# Altium project OBDH_Ed01r1.PrjPcb
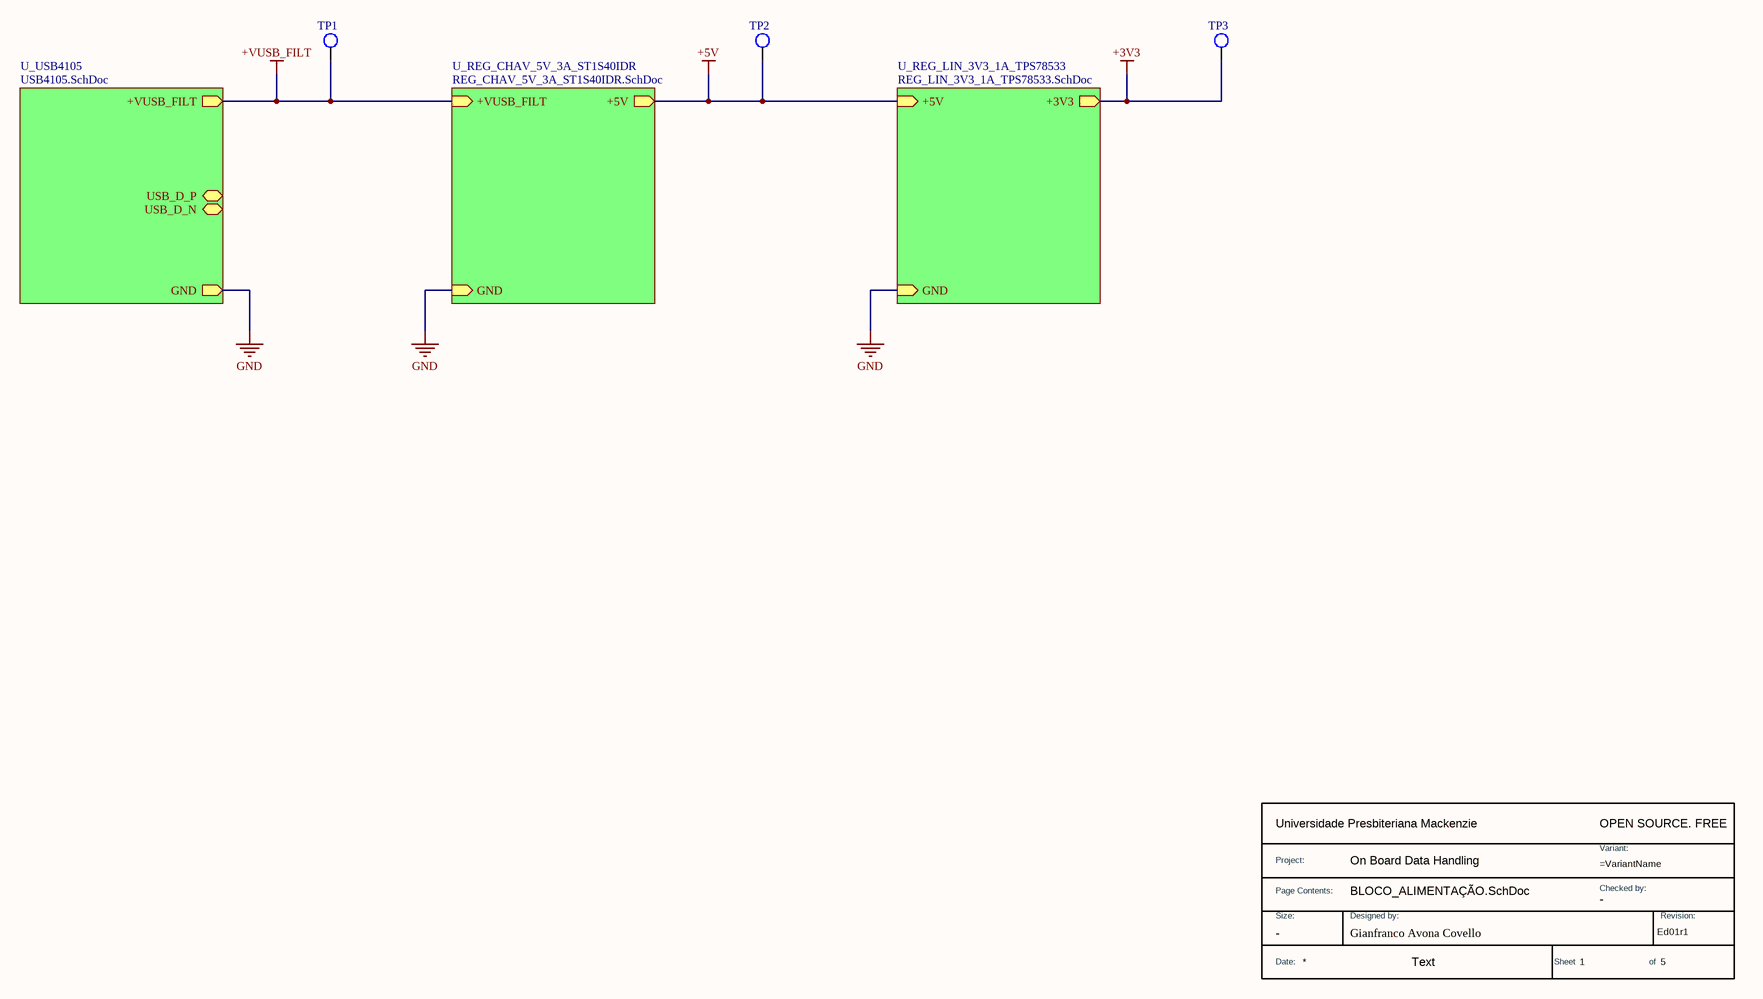
[diagram p0: BLOCO_ALIMENTAÇÃO.SchDoc]
Company: Universidade Presbiteriana Mackenzie; Project: On Board Data Handling; ProjectEngineer: Gianfranco Avona Covello; VersionRevision: Ed01r1
9 sheets, 96 parts. Net scope: hierarchical (ports join the sheet entries above them; power ports are global).
Sheets:
  BLOCO_ALIMENTAÇÃO.SchDoc
    U_USB4105 = USB4105.SchDoc
    U_REG_CHAV_5V_3A_ST1S40IDR = REG_CHAV_5V_3A_ST1S40IDR.SchDoc
    U_REG_LIN_3V3_1A_TPS78533 = REG_LIN_3V3_1A_TPS78533.SchDoc
  BLOCO_PROCESSAMENTO.SchDoc
    U_STM32L412CBT6 = STM32L412CBT6.SchDoc
    U_MLX90393SLQ = MLX90393SLQ.SchDoc
    U_LSM6DSOTR = LSM6DSOTR.SchDoc
  ADF7020BCPZ-RL.SchDoc

## Sheet BLOCO_ALIMENTAÇÃO.SchDoc
size A3; Engineer: Gianfranco Avona Covello; SheetNumber: 1; SheetTotal: 5

### Parts
(Parts that share a designator on the sheet are numbered #1, #2 ... from top to bottom, then left to right.)
*#1  DWG NO: Gianfranco Avona Covello  (hidden comment: TitleBlock)  (graphical)
TP1  TEST_POINT_1.5MM  [TESTPOINT_1.5MM]  (value not drawn)  (no BOM)
TP2  TEST_POINT_1.5MM  [TESTPOINT_1.5MM]  (value not drawn)  (no BOM)
TP3  TEST_POINT_1.5MM  [TESTPOINT_1.5MM]  (value not drawn)  (no BOM)

### Sub-sheets
U_REG_CHAV_5V_3A_ST1S40IDR = REG_CHAV_5V_3A_ST1S40IDR.SchDoc: +VUSB_FILT (in), +5V (out), GND (in)
U_REG_LIN_3V3_1A_TPS78533 = REG_LIN_3V3_1A_TPS78533.SchDoc: +5V (in), GND (in), +3V3 (out)
U_USB4105 = USB4105.SchDoc: USB_D_P (bidir), USB_D_N (bidir), +VUSB_FILT (out), GND (out)

### Nets
+3V3: TP3.1 ; sheet U_REG_LIN_3V3_1A_TPS78533/+3V3
+5V: TP2.1 ; sheet U_REG_CHAV_5V_3A_ST1S40IDR/+5V, sheet U_REG_LIN_3V3_1A_TPS78533/+5V
+VUSB_FILT: TP1.1 ; sheet U_USB4105/+VUSB_FILT, sheet U_REG_CHAV_5V_3A_ST1S40IDR/+VUSB_FILT
GND: sheet U_USB4105/GND, sheet U_REG_CHAV_5V_3A_ST1S40IDR/GND, sheet U_REG_LIN_3V3_1A_TPS78533/GND

### Notes on the sheet
- Todas as informações e detalhes técnicos deste documento são de inteira propriedade da empresa V2COM,
- não poderão ser copiados, reduzidos ou cedidos a terceiros sem prévia autorização por escrito da mesma.
- Salvo em (D/M/A):
- Página:
- de
- Nome do Projeto:
- https://v2com.com/
- Ed.:
- Responsável:
- Nome da página:
- Rev.:
- Projetista:
- Obs.:
- Revisor:
- Arquivo:
- -
- (in symbol TitleBlock) OPEN SOURCE. FREE; Project:; Variant:; Page Contents:; Checked by:; Size:; Designed by:; Revision:; Date:; Text; Sheet; of

### Library data of the parts
*#1 = TitleBlock: Standard Title Block; Size: -; Checked by: -
TP1-TP3 = TEST_POINT_1.5MM: TEST_POINT; Manufacturer: V2COM; Origem: GT1021_ED02r2; Case/Package: SMD; Manufacturer Part Number: TEST_POINT; Observação: *; Valor: *

## Sheet USB4105.SchDoc
size A4; Engineer: Gianfranco Avona Covello; SheetNumber: 2; SheetTotal: 8
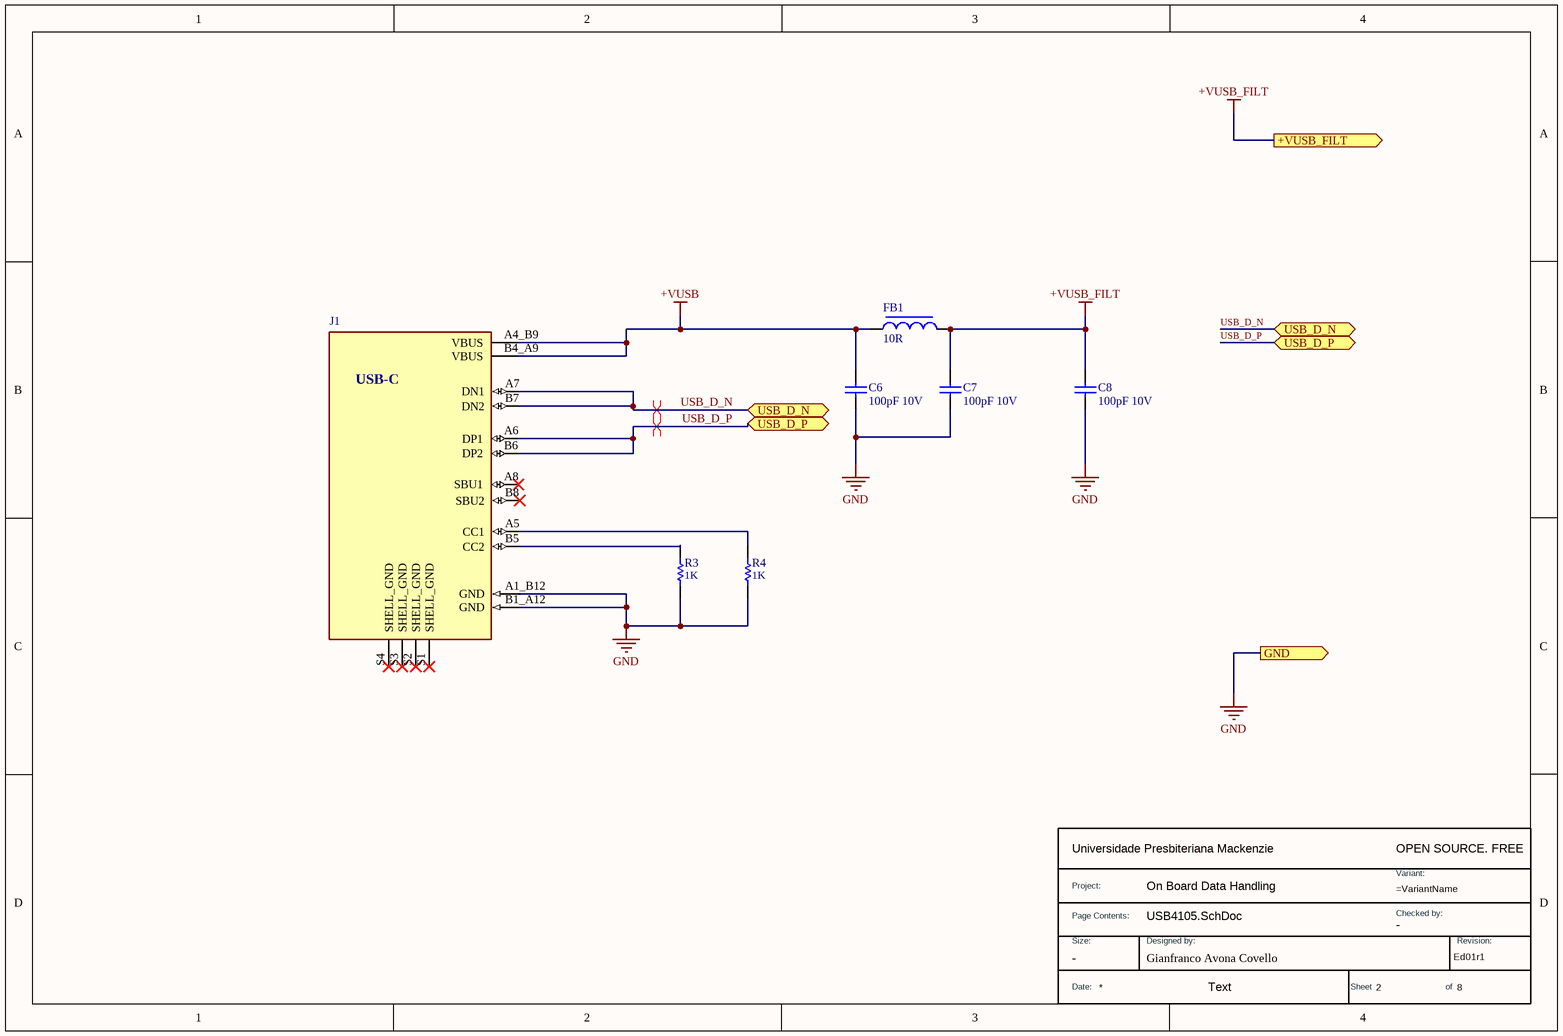
[diagram p1: USB4105.SchDoc]

### Parts
(Parts that share a designator on the sheet are numbered #1, #2 ... from top to bottom, then left to right.)
*#2  DWG NO: Gianfranco Avona Covello  (hidden comment: TitleBlock)  (graphical)
C6  value 100pF 10V  (hidden comment: _Capacitor)
C7  value 100pF 10V  (hidden comment: _Capacitor)
C8  value 100pF 10V  (hidden comment: _Capacitor)
FB1  value 10R  (hidden comment: _FERRITE)
J1  USB4105-GF-A  [GCT_USB4105-GF-A]  (value not drawn)
R3  value 1K  (hidden comment: _Resistor)
R4  value 1K  (hidden comment: _Resistor)

### Ports
+VUSB_FILT (out, see 1[3B], 3[1A]), GND (out, see 1[3C], 3[1A], 4[1A]), USB_D_N (bidir, see 1[3B]), USB_D_P (bidir, see 1[3B])

### Nets
+VUSB: C6.2 FB1.1 J1.A4_B9(VBUS) J1.B4_A9(VBUS)
+VUSB_FILT: C7.2 C8.2 FB1.2 ; port +VUSB_FILT
GND: C6.1 C7.1 C8.1 J1.A1_B12(GND) J1.B1_A12(GND) R3.1 R4.1 ; port GND
USB_D_N: J1.A7(DN1) J1.B7(DN2) ; port USB_D_N
USB_D_P: J1.A6(DP1) J1.B6(DP2) ; port USB_D_P
NetJ1_A5: J1.A5(CC1) R4.2
NetJ1_B5: J1.B5(CC2) R3.2

Not connected (* = marked no-connect by the designer): J1 A8(SBU1)* B8(SBU2)* S1(SHELL_GND)* S2(SHELL_GND)* S3(SHELL_GND)* S4(SHELL_GND)*

### Layout directives
differential pair; differential pair class USB: USB_D_N, USB_D_P

### Notes on the sheet
- Todas as informações e detalhes técnicos deste documento são de inteira propriedade da empresa V2COM,
- não poderão ser copiados, reduzidos ou cedidos a terceiros sem prévia autorização por escrito da mesma.
- Salvo em (D/M/A):
- Página:
- de
- Nome do Projeto:
- https://v2com.com/
- Ed.:
- Responsável:
- Nome da página:
- Rev.:
- Projetista:
- Obs.:
- Revisor:
- Arquivo:
- -
- (in symbol TitleBlock) OPEN SOURCE. FREE; Project:; Variant:; Page Contents:; Checked by:; Size:; Designed by:; Revision:; Date:; Text; Sheet; of
- (in symbol USB4105-GF-A) USB-C

### Library data of the parts
*#2 = TitleBlock: Standard Title Block; Size: -; Checked by: -
C6-C8 = _Capacitor: Capacitor; Published: 8-Jun-2000; LatestRevisionDate: 17-Jul-2002; LatestRevisionNote: Re-released for DXP Platform.; PackageReference: RAD-0.3; Publisher: Altium Limited; PackageDescription: Radial Cap, Thru-Hole; 2 Leads; 0.3 in Pin Spacing
FB1 = _FERRITE: Ferrite Bead; Code_IEC: 1005; Published: 8-Jun-2000; LatestRevisionDate: 29-May-2009; LatestRevisionNote: IPC-7351 Footprint Added.; PackageReference: 0402-A; Publisher: Altium Limited; PackageDescription: Chip Inductor; Code_JEITA: 0402
J1 = USB4105-GF-A: USB-C (USB TYPE-C) USB 2.0 Receptacle Connector 24 (16+8 Dummy) Position Surface Mount, Right Angle; Through Hole; MF: GCT; Price: None; Availability: In Stock; MP: USB4105-GF-A; Package: None; SnapEDA_Link: https://www.snapeda.com/parts/USB4105-GF-A/Global+Connector+Technology/view-part/?ref=snap; Check_prices: https://www.snapeda.com/parts/USB4105-GF-A/Global+Connector+Technology/view-part/?ref=eda; Value: *; Purchase-URL: https://pricing.snapeda.com/search/part/USB4105-GF-A/?ref=eda
R3 R4 = _Resistor: Resistor; Published: 8-Jun-2000; LatestRevisionDate: 17-Jul-2002; LatestRevisionNote: Re-released for DXP Platform.; PackageReference: AXIAL-0.3; Publisher: Altium Limited; PackageDescription: Axial Device, Thru-Hole; 2 Leads; 0.3 in Pin Spacing

## Sheet REG_CHAV_5V_3A_ST1S40IDR.SchDoc
size A4; Engineer: Gianfranco Avona Covello; SheetNumber: 3; SheetTotal: 8
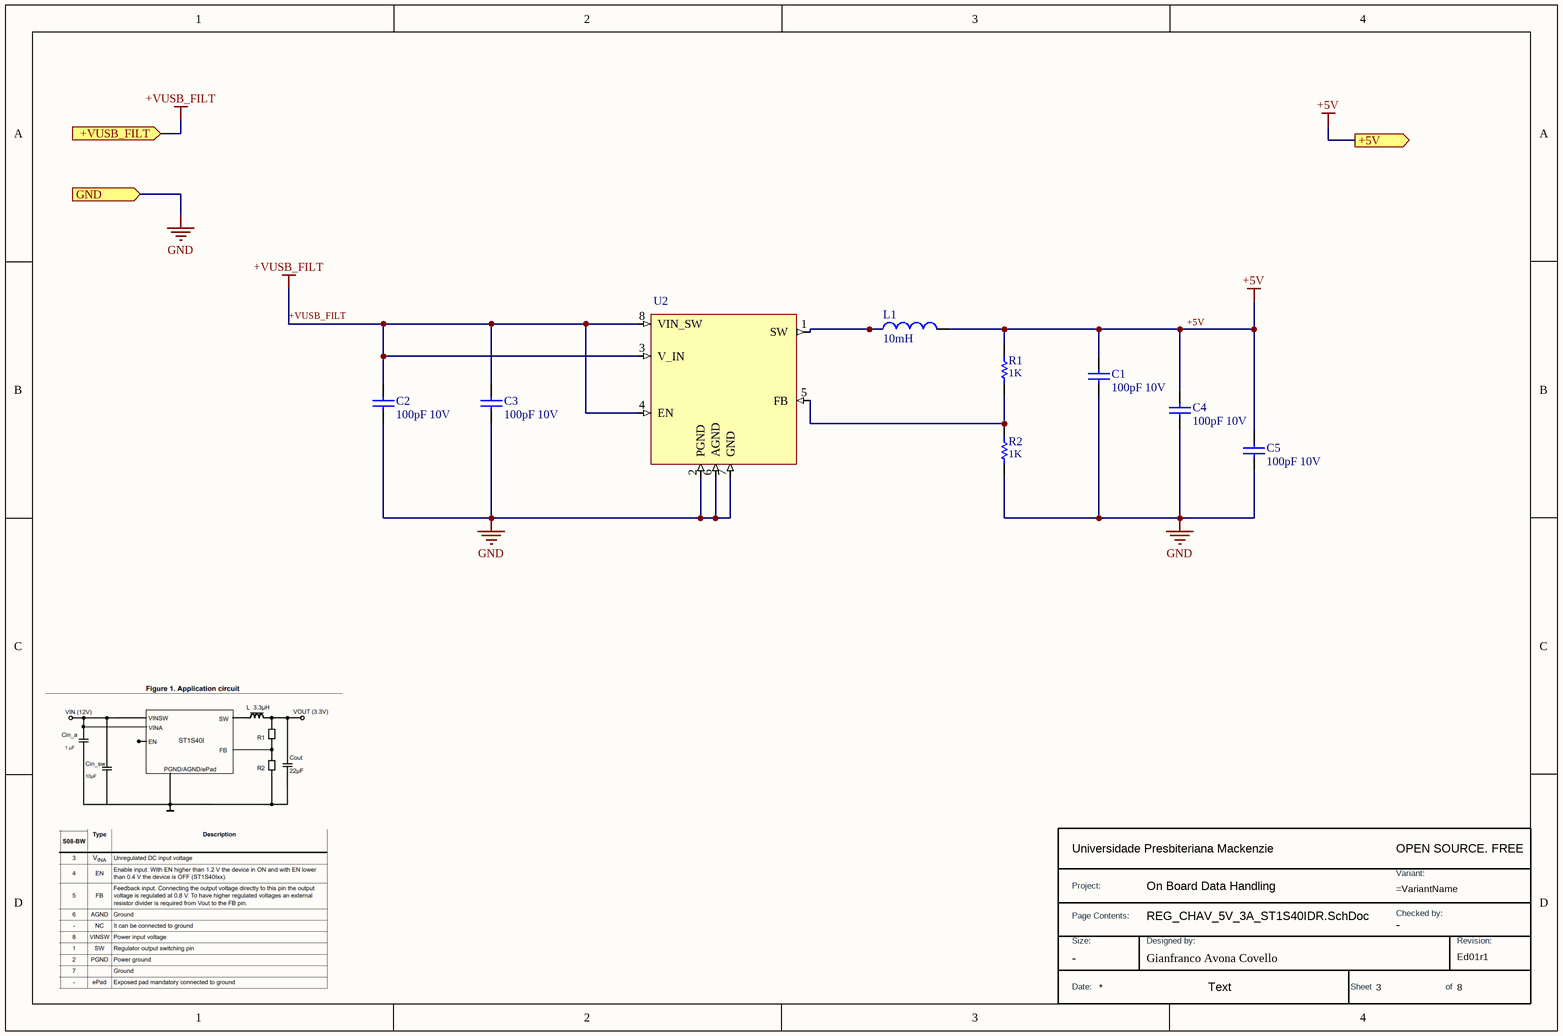
[diagram p2: REG_CHAV_5V_3A_ST1S40IDR.SchDoc]

### Parts
(Parts that share a designator on the sheet are numbered #1, #2 ... from top to bottom, then left to right.)
*#3  DWG NO: Gianfranco Avona Covello  (hidden comment: TitleBlock)  (graphical)
C1  value 100pF 10V  (hidden comment: _Capacitor)
C2  value 100pF 10V  (hidden comment: _Capacitor)
C3  value 100pF 10V  (hidden comment: _Capacitor)
C4  value 100pF 10V  (hidden comment: _Capacitor)
C5  value 100pF 10V  (hidden comment: _Capacitor)
L1  value 10mH  (hidden comment: _Inductor)
R1  value 1K  (hidden comment: _Resistor)
R2  value 1K  (hidden comment: _Resistor)
U2  ST1S40IDR  (value not drawn)

### Ports
+5V (out, see 1[4B], 4[1A]), +VUSB_FILT (in, see 1[3B], 2[4A]), GND (in, see 1[3C], 2[4A], 4[1A])

### Nets
+5V: C1.2 C4.2 C5.2 L1.2 R1.2 ; port +5V
+VUSB_FILT: C2.2 C3.2 U2.3(V_IN) U2.4(EN) U2.8(VIN_SW) ; port +VUSB_FILT
GND: C1.1 C2.1 C3.1 C4.1 C5.1 R2.1 U2.2(PGND) U2.6(AGND) U2.7(GND) ; port GND
NetL1_1: L1.1 U2.1(SW)
NetR1_1: R1.1 R2.2 U2.5(FB)

### Notes on the sheet
- Todas as informações e detalhes técnicos deste documento são de inteira propriedade da empresa V2COM,
- não poderão ser copiados, reduzidos ou cedidos a terceiros sem prévia autorização por escrito da mesma.
- Salvo em (D/M/A):
- Página:
- de
- Nome do Projeto:
- https://v2com.com/
- Ed.:
- Responsável:
- Nome da página:
- Rev.:
- Projetista:
- Obs.:
- Revisor:
- Arquivo:
- -
- (in symbol TitleBlock) OPEN SOURCE. FREE; Project:; Variant:; Page Contents:; Checked by:; Size:; Designed by:; Revision:; Date:; Text; Sheet; of

### Library data of the parts
*#3 = TitleBlock: Standard Title Block; Size: -; Checked by: -
C1-C5 = _Capacitor: Capacitor; Published: 8-Jun-2000; LatestRevisionDate: 17-Jul-2002; LatestRevisionNote: Re-released for DXP Platform.; PackageReference: RAD-0.3; Publisher: Altium Limited; PackageDescription: Radial Cap, Thru-Hole; 2 Leads; 0.3 in Pin Spacing
L1 = _Inductor: Inductor; Code_IEC: 1005; Published: 8-Jun-2000; LatestRevisionDate: 29-May-2009; LatestRevisionNote: IPC-7351 Footprint Added.; PackageReference: 0402-A; Publisher: Altium Limited; PackageDescription: Chip Inductor; Code_JEITA: 0402
R1 R2 = _Resistor: Resistor; Published: 8-Jun-2000; LatestRevisionDate: 17-Jul-2002; LatestRevisionNote: Re-released for DXP Platform.; PackageReference: AXIAL-0.3; Publisher: Altium Limited; PackageDescription: Axial Device, Thru-Hole; 2 Leads; 0.3 in Pin Spacing
U2 = ST1S40IDR: IC REG BUCK ADJUSTABLE 3A 8SO

## Sheet REG_LIN_3V3_1A_TPS78533.SchDoc
size A4; Engineer: Gianfranco Avona Covello; SheetNumber: 4; SheetTotal: 4
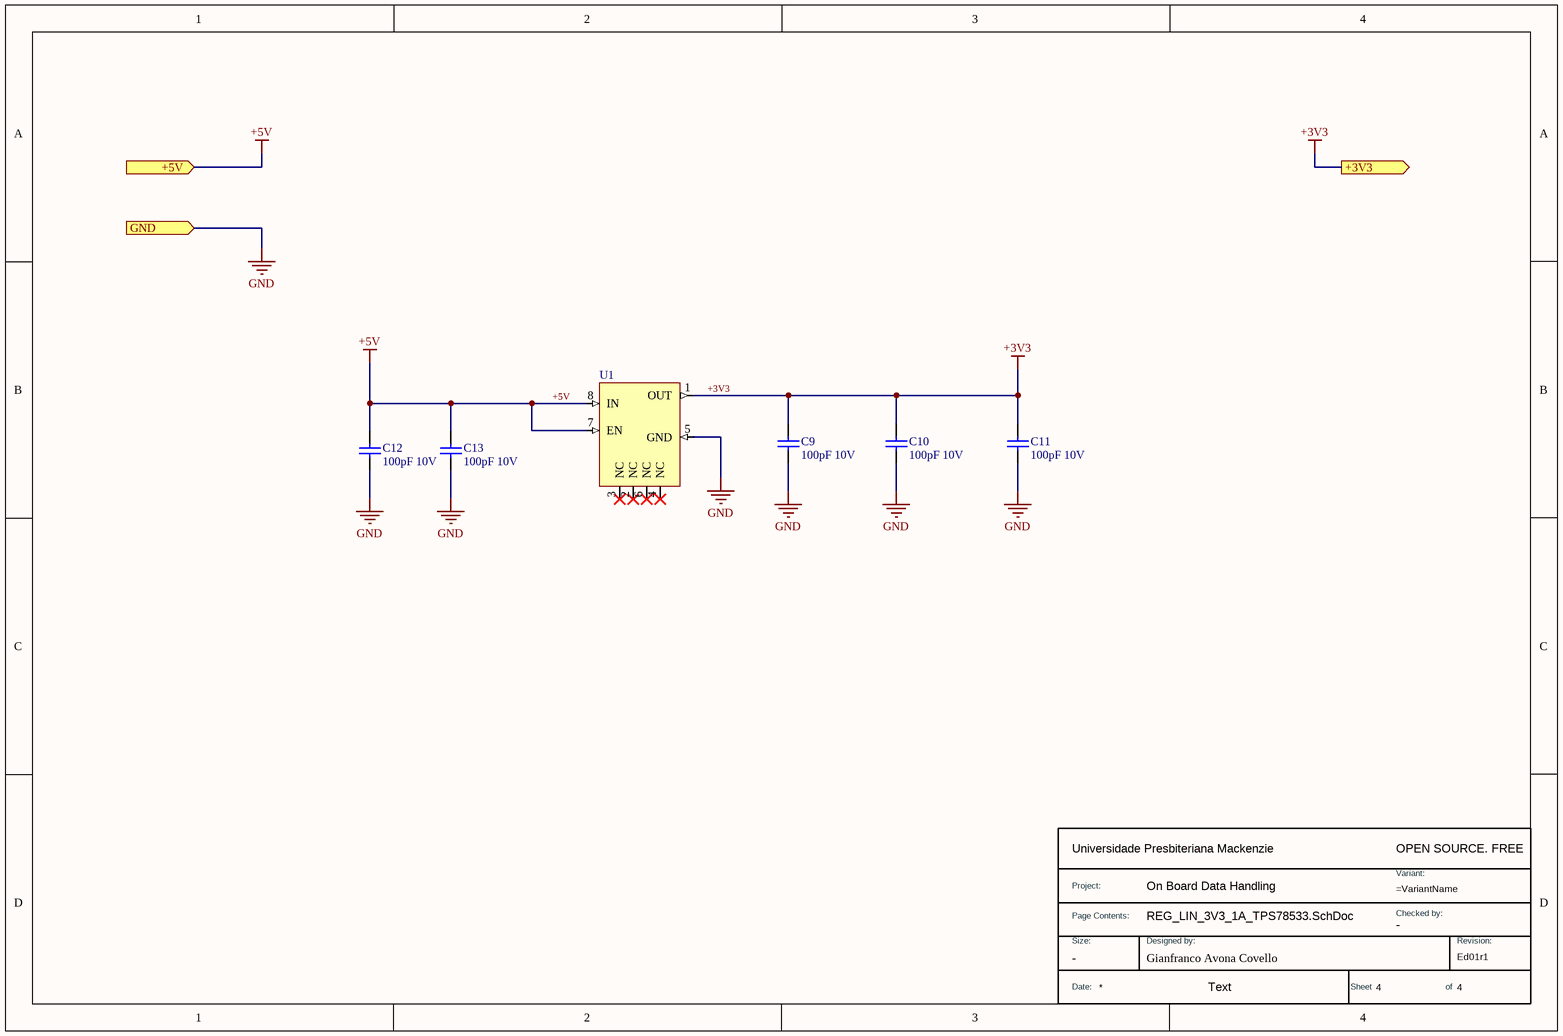
[diagram p3: REG_LIN_3V3_1A_TPS78533.SchDoc]

### Parts
(Parts that share a designator on the sheet are numbered #1, #2 ... from top to bottom, then left to right.)
*#4  DWG NO: Gianfranco Avona Covello  (hidden comment: TitleBlock)  (graphical)
C9  value 100pF 10V  (hidden comment: _Capacitor)
C10  value 100pF 10V  (hidden comment: _Capacitor)
C11  value 100pF 10V  (hidden comment: _Capacitor)
C12  value 100pF 10V  (hidden comment: _Capacitor)
C13  value 100pF 10V  (hidden comment: _Capacitor)
U1  TPS78533QWDRBRQ1  (value not drawn)

### Ports
+3V3 (out, see 1[7B]), +5V (in, see 1[6B], 3[4A]), GND (in, see 1[6C], 2[4A], 3[1A])

### Nets
+3V3: C9.1 C10.1 C11.1 U1.1(OUT) ; port +3V3
+5V: C12.1 C13.1 U1.7(EN) U1.8(IN) ; port +5V
GND: C9.2 C10.2 C11.2 C12.2 C13.2 U1.5(GND) ; port GND

Not connected (* = marked no-connect by the designer): U1 2(NC)* 3(NC)* 4(NC)* 6(NC)*

### Notes on the sheet
- Todas as informações e detalhes técnicos deste documento são de inteira propriedade da empresa V2COM,
- não poderão ser copiados, reduzidos ou cedidos a terceiros sem prévia autorização por escrito da mesma.
- Salvo em (D/M/A):
- Página:
- de
- Nome do Projeto:
- https://v2com.com/
- Ed.:
- Responsável:
- Nome da página:
- Rev.:
- Projetista:
- Obs.:
- Revisor:
- Arquivo:
- -
- (in symbol TitleBlock) OPEN SOURCE. FREE; Project:; Variant:; Page Contents:; Checked by:; Size:; Designed by:; Revision:; Date:; Text; Sheet; of

### Library data of the parts
*#4 = TitleBlock: Standard Title Block; Size: -; Checked by: -
C9-C13 = _Capacitor: Capacitor; Published: 8-Jun-2000; LatestRevisionDate: 17-Jul-2002; LatestRevisionNote: Re-released for DXP Platform.; PackageReference: RAD-0.3; Publisher: Altium Limited; PackageDescription: Radial Cap, Thru-Hole; 2 Leads; 0.3 in Pin Spacing
U1 = TPS78533QWDRBRQ1: Linear Voltage Regulator IC Positive Fixed 1 Output 1A 8-SON (3x3)

## Sheet BLOCO_PROCESSAMENTO.SchDoc
size A3; Engineer: Gianfranco Avona Covello; SheetNumber: 5; SheetTotal: 8
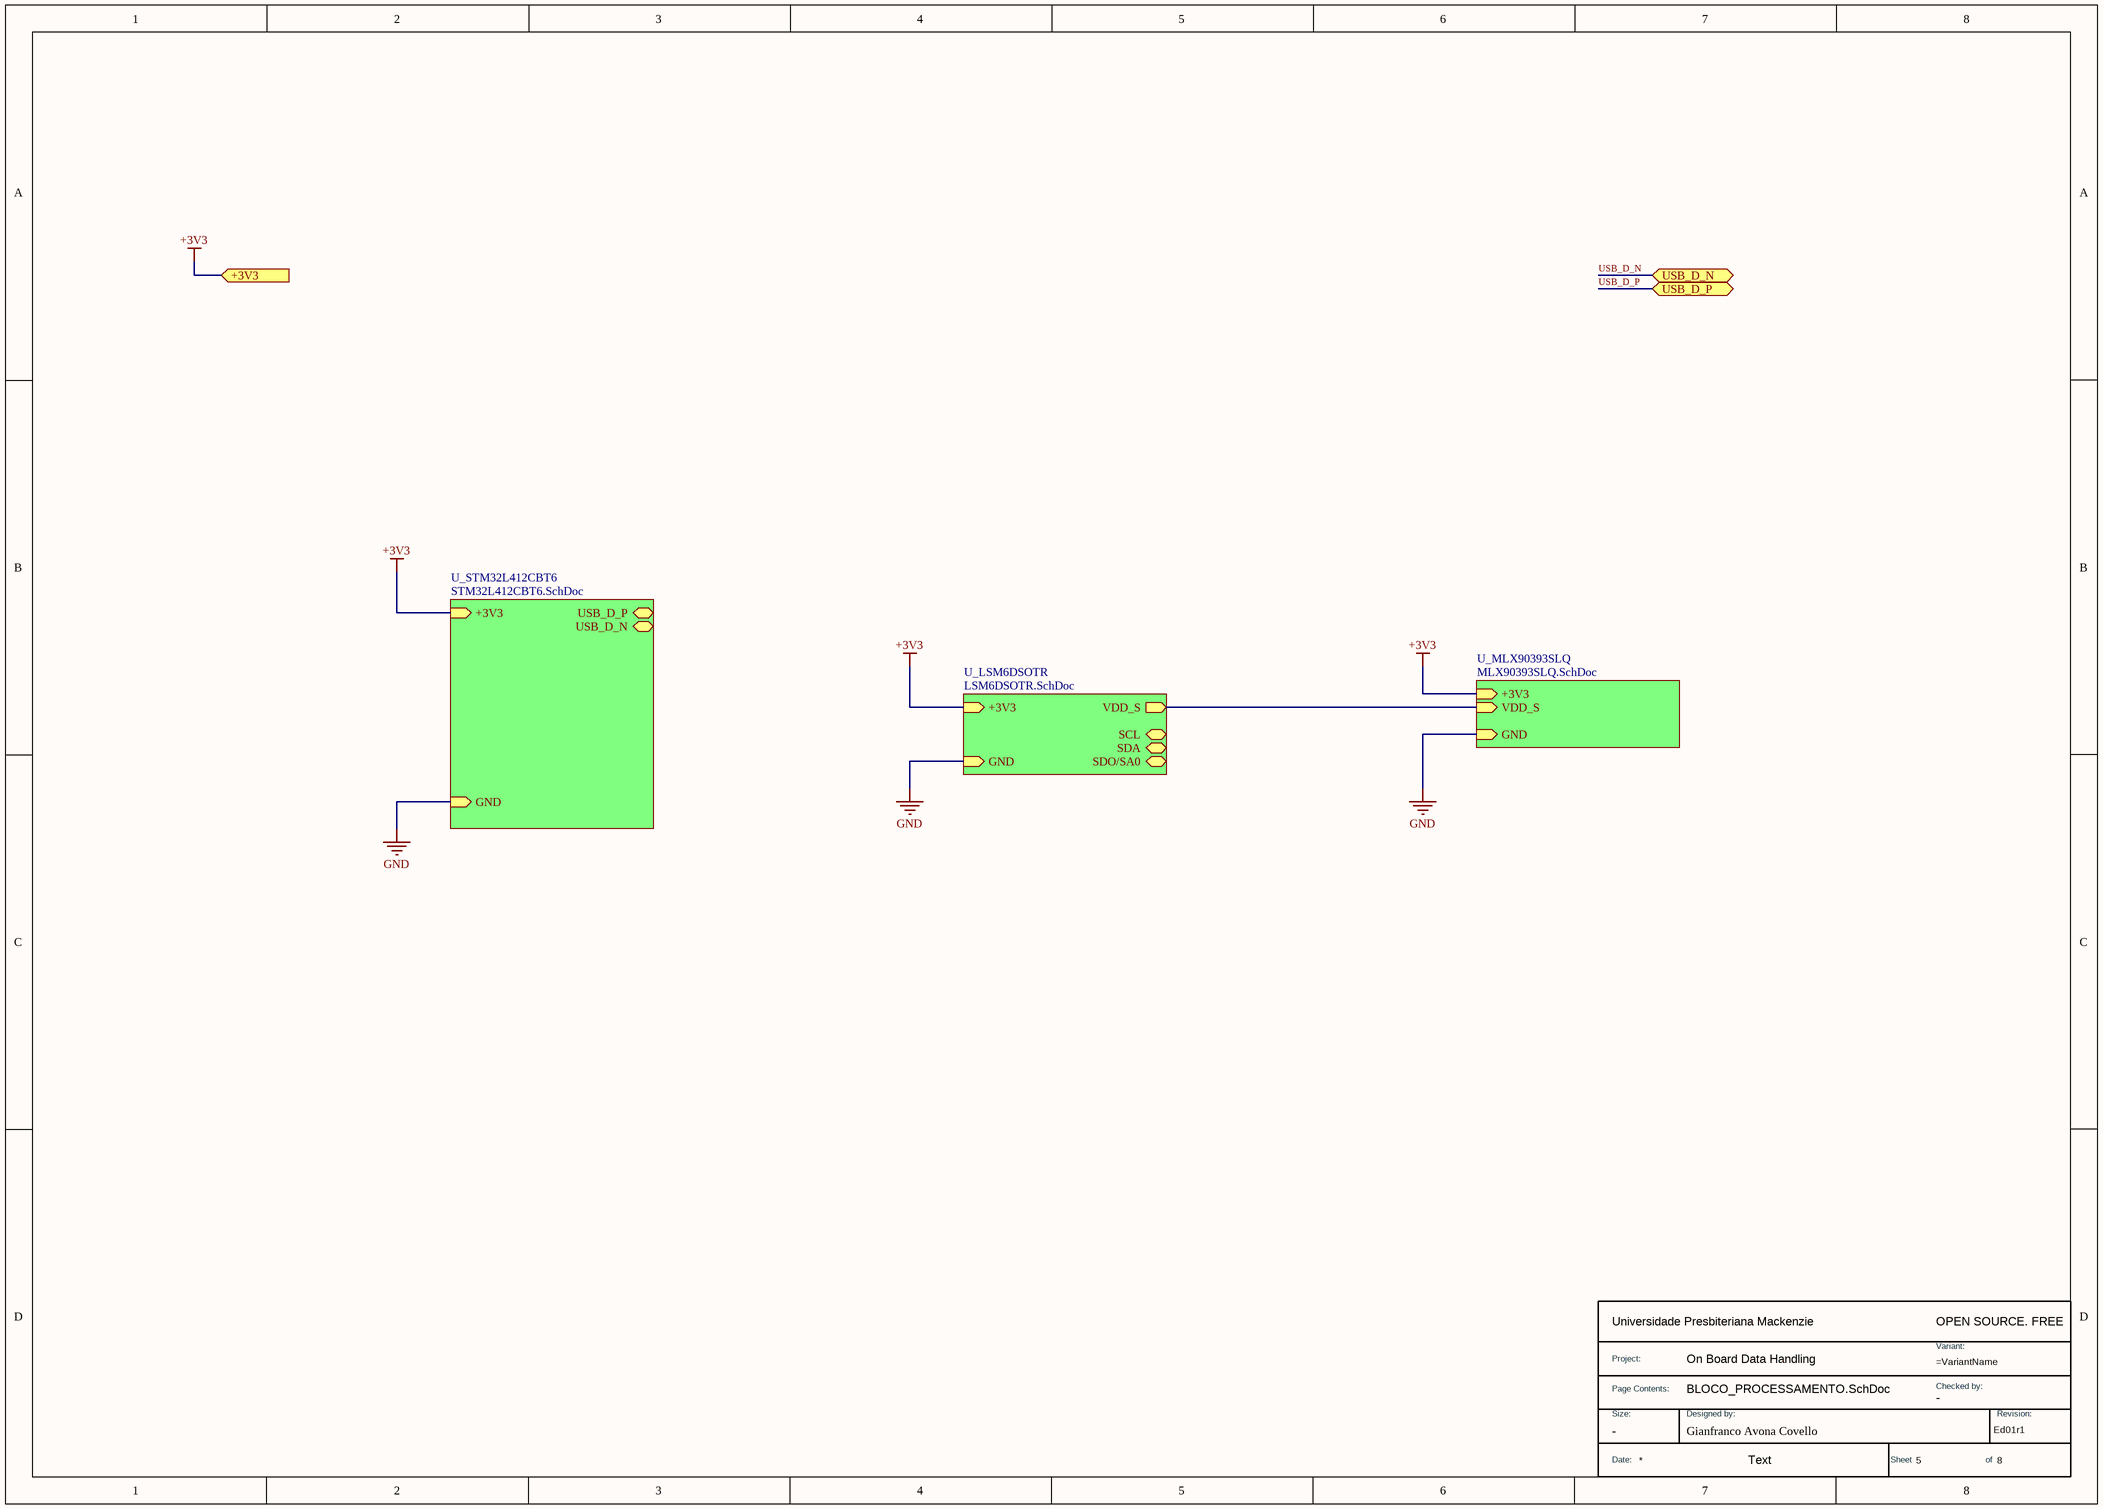
[diagram p4: BLOCO_PROCESSAMENTO.SchDoc]

### Parts
(Parts that share a designator on the sheet are numbered #1, #2 ... from top to bottom, then left to right.)
*#5  DWG NO: Gianfranco Avona Covello  (hidden comment: TitleBlock)  (graphical)

### Sub-sheets
U_LSM6DSOTR = LSM6DSOTR.SchDoc: GND (in), +3V3 (in), SCL (bidir), SDA (bidir), SDO/SA0 (bidir), VDD_S (out)
U_MLX90393SLQ = MLX90393SLQ.SchDoc: VDD_S (in), GND (in), +3V3 (in)
U_STM32L412CBT6 = STM32L412CBT6.SchDoc: +3V3 (in), USB_D_P (bidir), USB_D_N (bidir), GND (in)

### Ports
+3V3 (in, see 1[6B]), USB_D_N (bidir, see 1[3B]), USB_D_P (bidir, see 1[3B])

### Nets
+3V3: port +3V3, sheet U_STM32L412CBT6/+3V3, sheet U_MLX90393SLQ/+3V3, sheet U_LSM6DSOTR/+3V3
GND: sheet U_STM32L412CBT6/GND, sheet U_MLX90393SLQ/GND, sheet U_LSM6DSOTR/GND
USB_D_N: port USB_D_N
USB_D_P: port USB_D_P
(unnamed): sheet U_MLX90393SLQ/VDD_S, sheet U_LSM6DSOTR/VDD_S

### Notes on the sheet
- Todas as informações e detalhes técnicos deste documento são de inteira propriedade da empresa V2COM,
- não poderão ser copiados, reduzidos ou cedidos a terceiros sem prévia autorização por escrito da mesma.
- Salvo em (D/M/A):
- Página:
- de
- Nome do Projeto:
- https://v2com.com/
- Ed.:
- Responsável:
- Nome da página:
- Rev.:
- Projetista:
- Obs.:
- Revisor:
- Arquivo:
- -
- (in symbol TitleBlock) OPEN SOURCE. FREE; Project:; Variant:; Page Contents:; Checked by:; Size:; Designed by:; Revision:; Date:; Text; Sheet; of

### Library data of the parts
*#5 = TitleBlock: Standard Title Block; Size: -; Checked by: -

## Sheet STM32L412CBT6.SchDoc
size A3; Engineer: Gianfranco Avona Covello; SheetNumber: 6; SheetTotal: 9
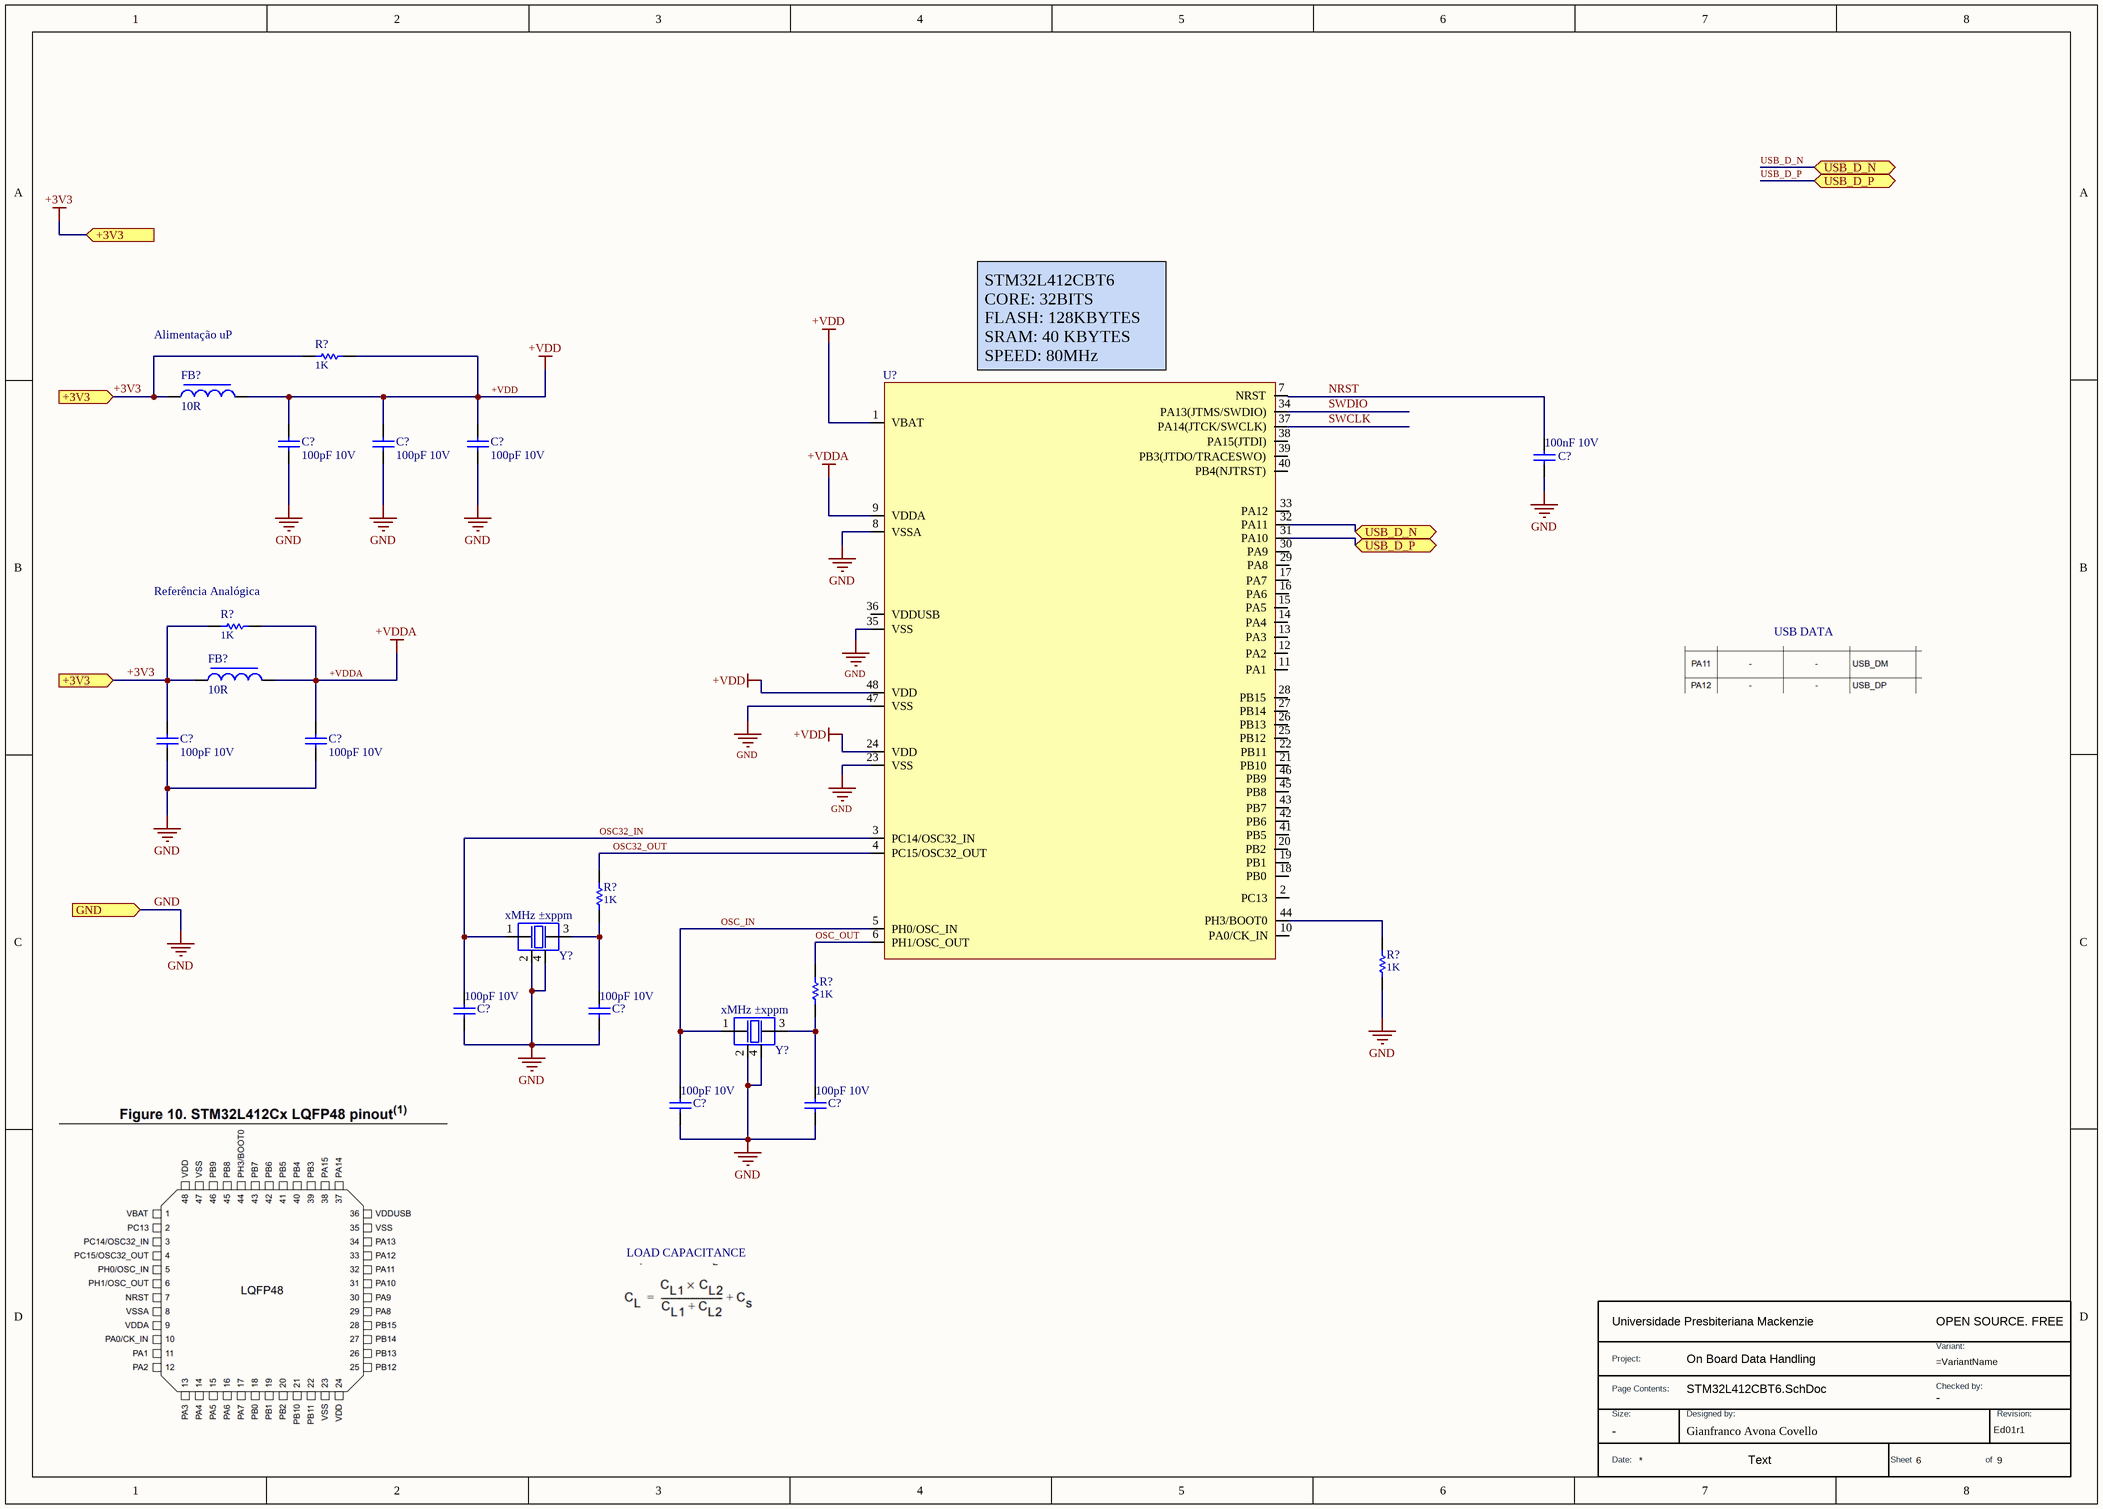
[diagram p5: STM32L412CBT6.SchDoc]

### Parts
(Parts that share a designator on the sheet are numbered #1, #2 ... from top to bottom, then left to right.)
*#6  DWG NO: Gianfranco Avona Covello  (hidden comment: TitleBlock)  (graphical)
C?#1  value 100pF 10V  (hidden comment: _Capacitor)
C?#2  value 100pF 10V  (hidden comment: _Capacitor)
C?#3  value 100pF 10V  (hidden comment: _Capacitor)
C?#4  value 100nF 10V  (hidden comment: _Capacitor)
C?#5  value 100pF 10V  (hidden comment: _Capacitor)
C?#6  value 100pF 10V  (hidden comment: _Capacitor)
C?#7  value 100pF 10V  (hidden comment: _Capacitor)
C?#8  value 100pF 10V  (hidden comment: _Capacitor)
C?#9  value 100pF 10V  (hidden comment: _Capacitor)
C?#10  value 100pF 10V  (hidden comment: _Capacitor)
FB?#1  value 10R  (hidden comment: _FERRITE)
FB?#2  value 10R  (hidden comment: _FERRITE)
R?#1  value 1K  (hidden comment: _Resistor)
R?#2  value 1K  (hidden comment: _Resistor)
R?#3  value 1K  (hidden comment: _Resistor)
R?#4  value 1K  (hidden comment: _Resistor)
R?#5  value 1K  (hidden comment: _Resistor)
U?#1  STM32L412CBT6  [IC LQFP48]  (value not drawn)
Y?#1  Valor: xMHz ±xppm  (hidden comment: _Crystal)
Y?#2  Valor: xMHz ±xppm  (hidden comment: _Crystal)

### Ports
+3V3 (in, see 1[6B]), GND (in, see 1[3C], 2[4A], 4[1A]), USB_D_N (bidir, see 1[3B]), USB_D_P (bidir, see 1[3B])

### Nets
+3V3: C?#5.2 FB?#1.1 FB?#2.1 R?#1.1 R?#2.1 ; port +3V3
+VDD: C?#1.1 C?#2.1 C?#3.1 FB?#1.2 R?#1.2 U?#1.1(VBAT) U?#1.24(VDD) U?#1.48(VDD)
+VDDA: C?#6.2 FB?#2.2 R?#2.2 U?#1.9(VDDA)
GND: C?#1.2 C?#2.2 C?#3.2 C?#4.1 C?#5.1 C?#6.1 C?#7.1 C?#8.1 C?#9.1 C?#10.1 R?#4.1 U?#1.8(VSSA) U?#1.23(VSS) U?#1.35(VSS) U?#1.47(VSS) Y?#1.2 Y?#1.4 Y?#2.2 Y?#2.4 ; port GND
NRST: C?#4.2
OSC32_IN: C?#7.2 U?#1.3(PC14/OSC32_IN) Y?#1.1
OSC32_OUT: R?#3.2 U?#1.4(PC15/OSC32_OUT)
OSC_IN: C?#9.2 U?#1.5(PH0/OSC_IN) Y?#2.1
OSC_OUT: R?#5.2 U?#1.6(PH1/OSC_OUT)
SWCLK: U?#1.37(PA14(JTCK/SWCLK))
SWDIO: U?#1.34(PA13(JTMS/SWDIO))
USB_D_N: U?#1.32(PA11) ; port USB_D_N
USB_D_P: U?#1.31(PA10) ; port USB_D_P
NetC?#8_2: C?#8.2 R?#3.1 Y?#1.3
NetC?#10_2: C?#10.2 R?#5.1 Y?#2.3
NetR?#4_2: R?#4.2 U?#1.44(PH3/BOOT0)

Not connected (* = marked no-connect by the designer): U?#1 2(PC13) 7(NRST) 10(PA0/CK_IN) 11(PA1) 12(PA2) 13(PA3) 14(PA4) 15(PA5) 16(PA6) 17(PA7) 18(PB0) 19(PB1) 20(PB2) 21(PB10) 22(PB11) 25(PB12) 26(PB13) 27(PB14) 28(PB15) 29(PA8) 30(PA9) 33(PA12) 36(VDDUSB) 38(PA15(JTDI)) 39(PB3(JTDO/TRACESWO)) 40(PB4(NJTRST)) 41(PB5) 42(PB6) 43(PB7) 45(PB8) 46(PB9)

### Notes on the sheet
- Alimentação uP
- (near U?#1) STM32L412CBT6
  CORE: 32BITS
  FLASH: 128KBYTES
  SRAM: 40 KBYTES
  SPEED: 80MHz
- (near R?#2) Referência Analógica
- USB DATA
- LOAD CAPACITANCE
- Todas as informações e detalhes técnicos deste documento são de inteira propriedade da empresa V2COM,
- não poderão ser copiados, reduzidos ou cedidos a terceiros sem prévia autorização por escrito da mesma.
- Salvo em (D/M/A):
- Página:
- de
- Nome do Projeto:
- https://v2com.com/
- Ed.:
- Responsável:
- Nome da página:
- Rev.:
- Projetista:
- Obs.:
- Revisor:
- Arquivo:
- -
- (in symbol TitleBlock) OPEN SOURCE. FREE; Project:; Variant:; Page Contents:; Checked by:; Size:; Designed by:; Revision:; Date:; Text; Sheet; of

### Library data of the parts
*#6 = TitleBlock: Standard Title Block; Size: -; Checked by: -
C?#1-C?#10 = _Capacitor: Capacitor; Published: 8-Jun-2000; LatestRevisionDate: 17-Jul-2002; LatestRevisionNote: Re-released for DXP Platform.; PackageReference: RAD-0.3; Publisher: Altium Limited; PackageDescription: Radial Cap, Thru-Hole; 2 Leads; 0.3 in Pin Spacing
FB?#1 FB?#2 = _FERRITE: Ferrite Bead; Code_IEC: 1005; Published: 8-Jun-2000; LatestRevisionDate: 29-May-2009; LatestRevisionNote: IPC-7351 Footprint Added.; PackageReference: 0402-A; Publisher: Altium Limited; PackageDescription: Chip Inductor; Code_JEITA: 0402
R?#1-R?#5 = _Resistor: Resistor; Published: 8-Jun-2000; LatestRevisionDate: 17-Jul-2002; LatestRevisionNote: Re-released for DXP Platform.; PackageReference: AXIAL-0.3; Publisher: Altium Limited; PackageDescription: Axial Device, Thru-Hole; 2 Leads; 0.3 in Pin Spacing
U?#1 = STM32L412CBT6: ARM® Cortex®-M4 STM32L4 Microcontroller IC 32-Bit Single-Core 80MHz 128KB (128K x 8) FLASH 48-LQFP (7x7)
Y?#1 Y?#2 = _Crystal: Crystal; Manufacturer: Diodes Incorporated; Manufacturer Part Number: FL2400022; Origem: MTER_Ed01r1; Case/Package: SMD; Observação: *

## Sheet MLX90393SLQ.SchDoc
size A3; Engineer: Gianfranco Avona Covello; SheetNumber: 7; SheetTotal: 8
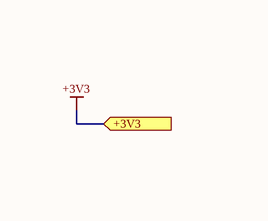
[diagram p6: MLX90393SLQ.SchDoc, top left]
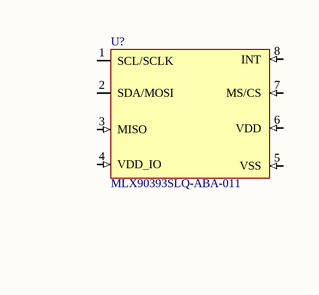
[diagram p7: MLX90393SLQ.SchDoc, top right]
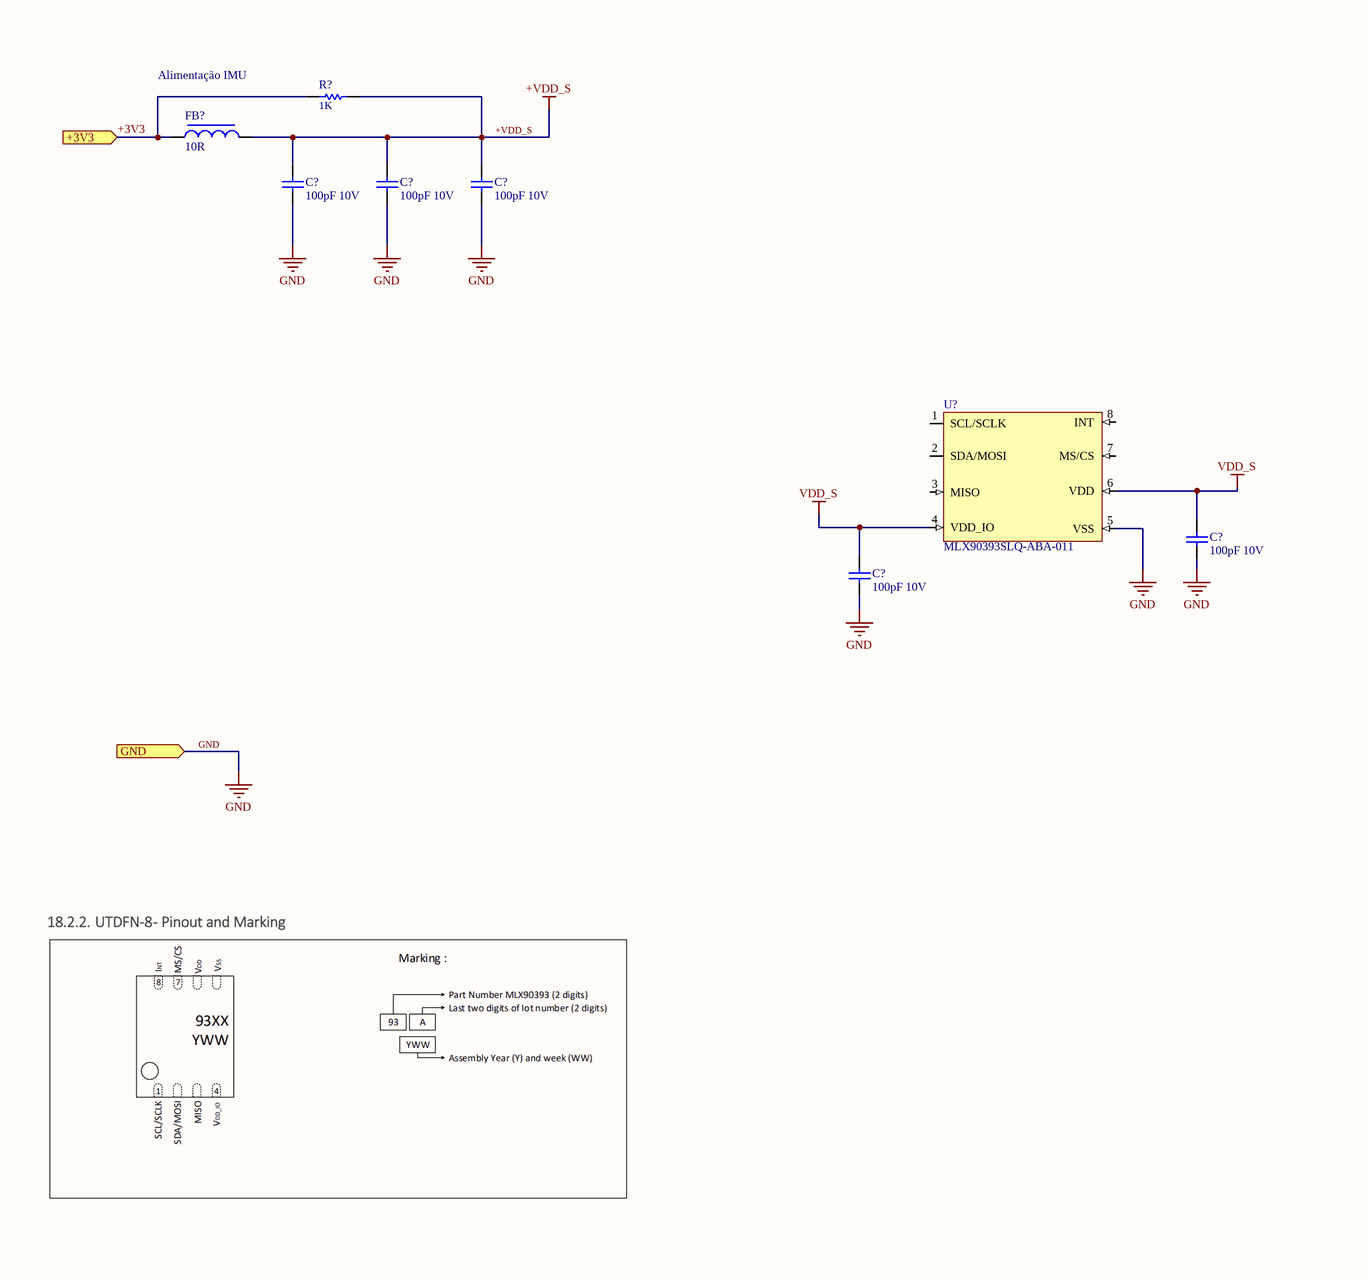
[diagram p8: MLX90393SLQ.SchDoc, bottom left]
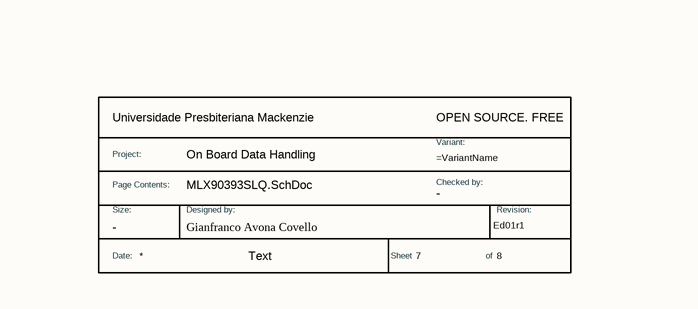
[diagram p9: MLX90393SLQ.SchDoc, bottom right]

### Parts
(Parts that share a designator on the sheet are numbered #1, #2 ... from top to bottom, then left to right.)
*#7  DWG NO: Gianfranco Avona Covello  (hidden comment: TitleBlock)  (graphical)
C?#11  value 100pF 10V  (hidden comment: _Capacitor)
C?#12  value 100pF 10V  (hidden comment: _Capacitor)
C?#13  value 100pF 10V  (hidden comment: _Capacitor)
C?#14  value 100pF 10V  (hidden comment: _Capacitor)
C?#15  value 100pF 10V  (hidden comment: _Capacitor)
FB?#3  value 10R  (hidden comment: _FERRITE)
R?#6  value 1K  (hidden comment: _Resistor)
U?#2  MLX90393SLQ-ABA-011
U?#3  MLX90393SLQ-ABA-011

### Ports
+3V3 (in, see 1[6B]), GND (in, see 1[3C], 2[4A], 4[1A])

### Nets
+3V3: FB?#3.1 R?#6.1 ; port +3V3
+VDD_S: C?#11.1 C?#12.1 C?#13.1 FB?#3.2 R?#6.2
GND: C?#11.2 C?#12.2 C?#13.2 C?#14.2 C?#15.2 U?#3.5(VSS) ; port GND
VDD_S: C?#14.1 C?#15.1 U?#3.4(VDD_IO) U?#3.6(VDD)

Not connected (* = marked no-connect by the designer): U?#2 1(SCL/SCLK) 2(SDA/MOSI) 3(MISO) 4(VDD_IO) 5(VSS) 6(VDD) 7(MS/CS) 8(INT); U?#3 1(SCL/SCLK) 2(SDA/MOSI) 3(MISO) 7(MS/CS) 8(INT)

### Notes on the sheet
- Alimentação IMU
- Todas as informações e detalhes técnicos deste documento são de inteira propriedade da empresa V2COM,
- não poderão ser copiados, reduzidos ou cedidos a terceiros sem prévia autorização por escrito da mesma.
- Salvo em (D/M/A):
- Página:
- de
- Nome do Projeto:
- https://v2com.com/
- Ed.:
- Responsável:
- Nome da página:
- Rev.:
- Projetista:
- Obs.:
- Revisor:
- Arquivo:
- -
- (in symbol TitleBlock) OPEN SOURCE. FREE; Project:; Variant:; Page Contents:; Checked by:; Size:; Designed by:; Revision:; Date:; Text; Sheet; of

### Library data of the parts
*#7 = TitleBlock: Standard Title Block; Size: -; Checked by: -
C?#11-C?#15 = _Capacitor: Capacitor; Published: 8-Jun-2000; LatestRevisionDate: 17-Jul-2002; LatestRevisionNote: Re-released for DXP Platform.; PackageReference: RAD-0.3; Publisher: Altium Limited; PackageDescription: Radial Cap, Thru-Hole; 2 Leads; 0.3 in Pin Spacing
FB?#3 = _FERRITE: Ferrite Bead; Code_IEC: 1005; Published: 8-Jun-2000; LatestRevisionDate: 29-May-2009; LatestRevisionNote: IPC-7351 Footprint Added.; PackageReference: 0402-A; Publisher: Altium Limited; PackageDescription: Chip Inductor; Code_JEITA: 0402
R?#6 = _Resistor: Resistor; Published: 8-Jun-2000; LatestRevisionDate: 17-Jul-2002; LatestRevisionNote: Re-released for DXP Platform.; PackageReference: AXIAL-0.3; Publisher: Altium Limited; PackageDescription: Axial Device, Thru-Hole; 2 Leads; 0.3 in Pin Spacing
U?#2 U?#3 = MLX90393SLQ-ABA-011: IC MAGNOMETER SPI/I2C 8UTDFN

## Sheet LSM6DSOTR.SchDoc
size A3; Engineer: Gianfranco Avona Covello; SheetNumber: 4; SheetTotal: 7
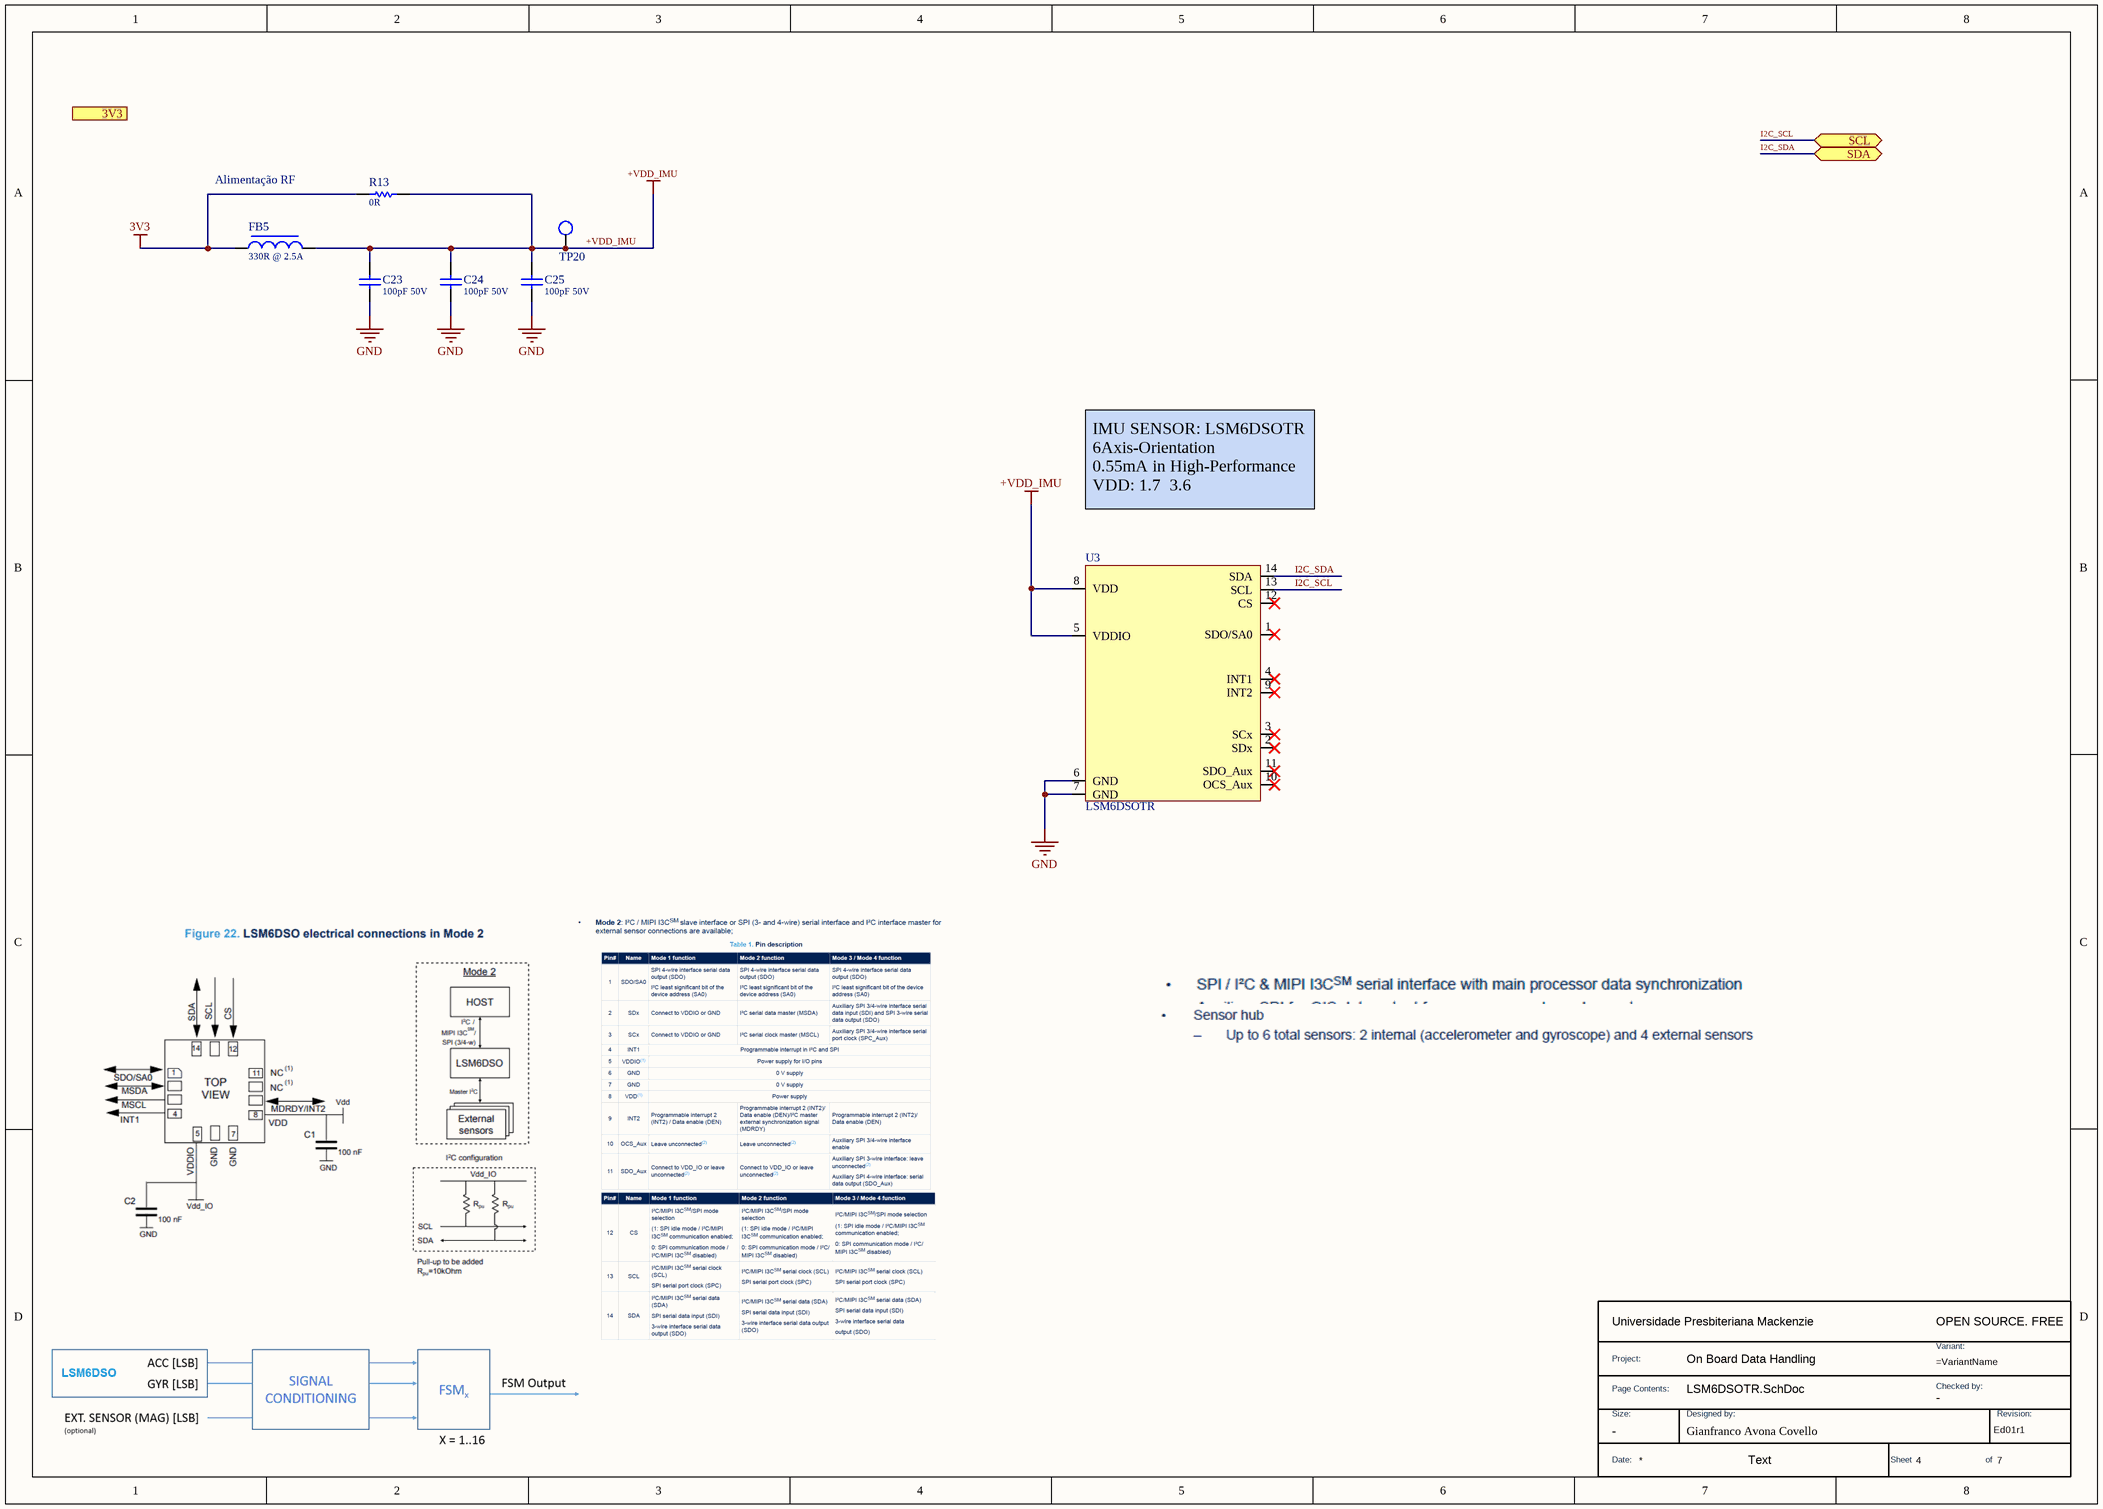
[diagram p10: LSM6DSOTR.SchDoc]

### Parts
(Parts that share a designator on the sheet are numbered #1, #2 ... from top to bottom, then left to right.)
*#8  DWG NO: Gianfranco Avona Covello  (hidden comment: TitleBlock)  (graphical)
C23  Valor: 100pF 50V  [CAP_0805]  (hidden comment: CC0805JRNPO9BN101)
C24  Valor: 100pF 50V  [CAP_0805]  (hidden comment: CC0805JRNPO9BN101)
C25  Valor: 100pF 50V  [CAP_0805]  (hidden comment: CC0805JRNPO9BN101)
FB5  Valor: 330R @ 2.5A  [IND_0805]  (hidden comment: MPZ2012S331AT000)
R13  Valor: 0R  [RES_0805]  (hidden comment: RC0805JR-070RL)
TP20  TEST_POINT_1.5MM  [TESTPOINT_1.5MM]  (value not drawn)  (no BOM)
U3  LSM6DSOTR  [IC_IIM-42351]

### Ports
3V3 (in, see 1[6A], 3[8B], 5[1B], 6[1A], 7[1A]), SCL (bidir, see 1[6A], 6[8C]), SDA (bidir, see 1[6A], 6[8C])

### Nets
3V3: FB5.1 R13.1
+VDD_IMU: C23.2 C24.2 C25.2 FB5.2 R13.2 TP20.1 U3.5(VDDIO) U3.8(VDD)
GND: C23.1 C24.1 C25.1 U3.6(GND) U3.7(GND)
I2C_SCL: U3.13(SCL) ; port SCL
I2C_SDA: U3.14(SDA) ; port SDA

Not connected (* = marked no-connect by the designer): U3 1(SDO/SA0)* 2(SDx)* 3(SCx)* 4(INT1)* 9(INT2)* 10(OCS_Aux)* 11(SDO_Aux)* 12(CS)*

### Notes on the sheet
- Alimentação RF
- IMU SENSOR: LSM6DSOTR
  6Axis-Orientation
  0.55mA in High-Performance
  VDD: 1.7  3.6
- Todas as informações e detalhes técnicos deste documento são de inteira propriedade da empresa V2COM,
- não poderão ser copiados, reduzidos ou cedidos a terceiros sem prévia autorização por escrito da mesma.
- Salvo em (D/M/A):
- Página:
- de
- Nome do Projeto:
- https://v2com.com/
- Ed.:
- Responsável:
- Nome da página:
- Rev.:
- Projetista:
- Obs.:
- Revisor:
- Arquivo:
- -
- (in symbol TitleBlock) OPEN SOURCE. FREE; Project:; Variant:; Page Contents:; Checked by:; Size:; Designed by:; Revision:; Date:; Text; Sheet; of

### Library data of the parts
*#8 = TitleBlock: Standard Title Block; Size: -; Checked by: -
C23-C25 = CC0805JRNPO9BN101: CAP CER 100PF 50V C0G/NPO 0805; Manufacturer: YAGEO; Origem: OBDH_Ed02; Case/Package: 0805; Manufacturer Part Number: CC0805JRNPO9BN101; Observação: *
FB5 = MPZ2012S331AT000: FERRITE BEAD 330 OHM 0805 1LN; Manufacturer: TDK Corporation; Case/Package: 0805; Manufacturer Part Number: MPZ2012S331AT000; Origem: *; Observação: *
R13 = RC0805JR-070RL: RES 0 OHM JUMPER 1/8W 0805; Manufacturer: YAGEO; Case/Package: 0805; Manufacturer Part Number: RC0805JR-070RL; Origem: *; Observação: *
TP20 = TEST_POINT_1.5MM: TEST_POINT; Origem: -; Case/Package: SMD; Manufacturer: -; Manufacturer Part Number: TEST_POINT; Observação: *; Valor: *
U3 = LSM6DSOTR: Accelerometer, Gyroscope, 6 Axis Sensor I²C, SPI Output

## Sheet ADF7020BCPZ-RL.SchDoc
size A3; Engineer: Gianfranco Avona Covello; SheetNumber: 9; SheetTotal: 9
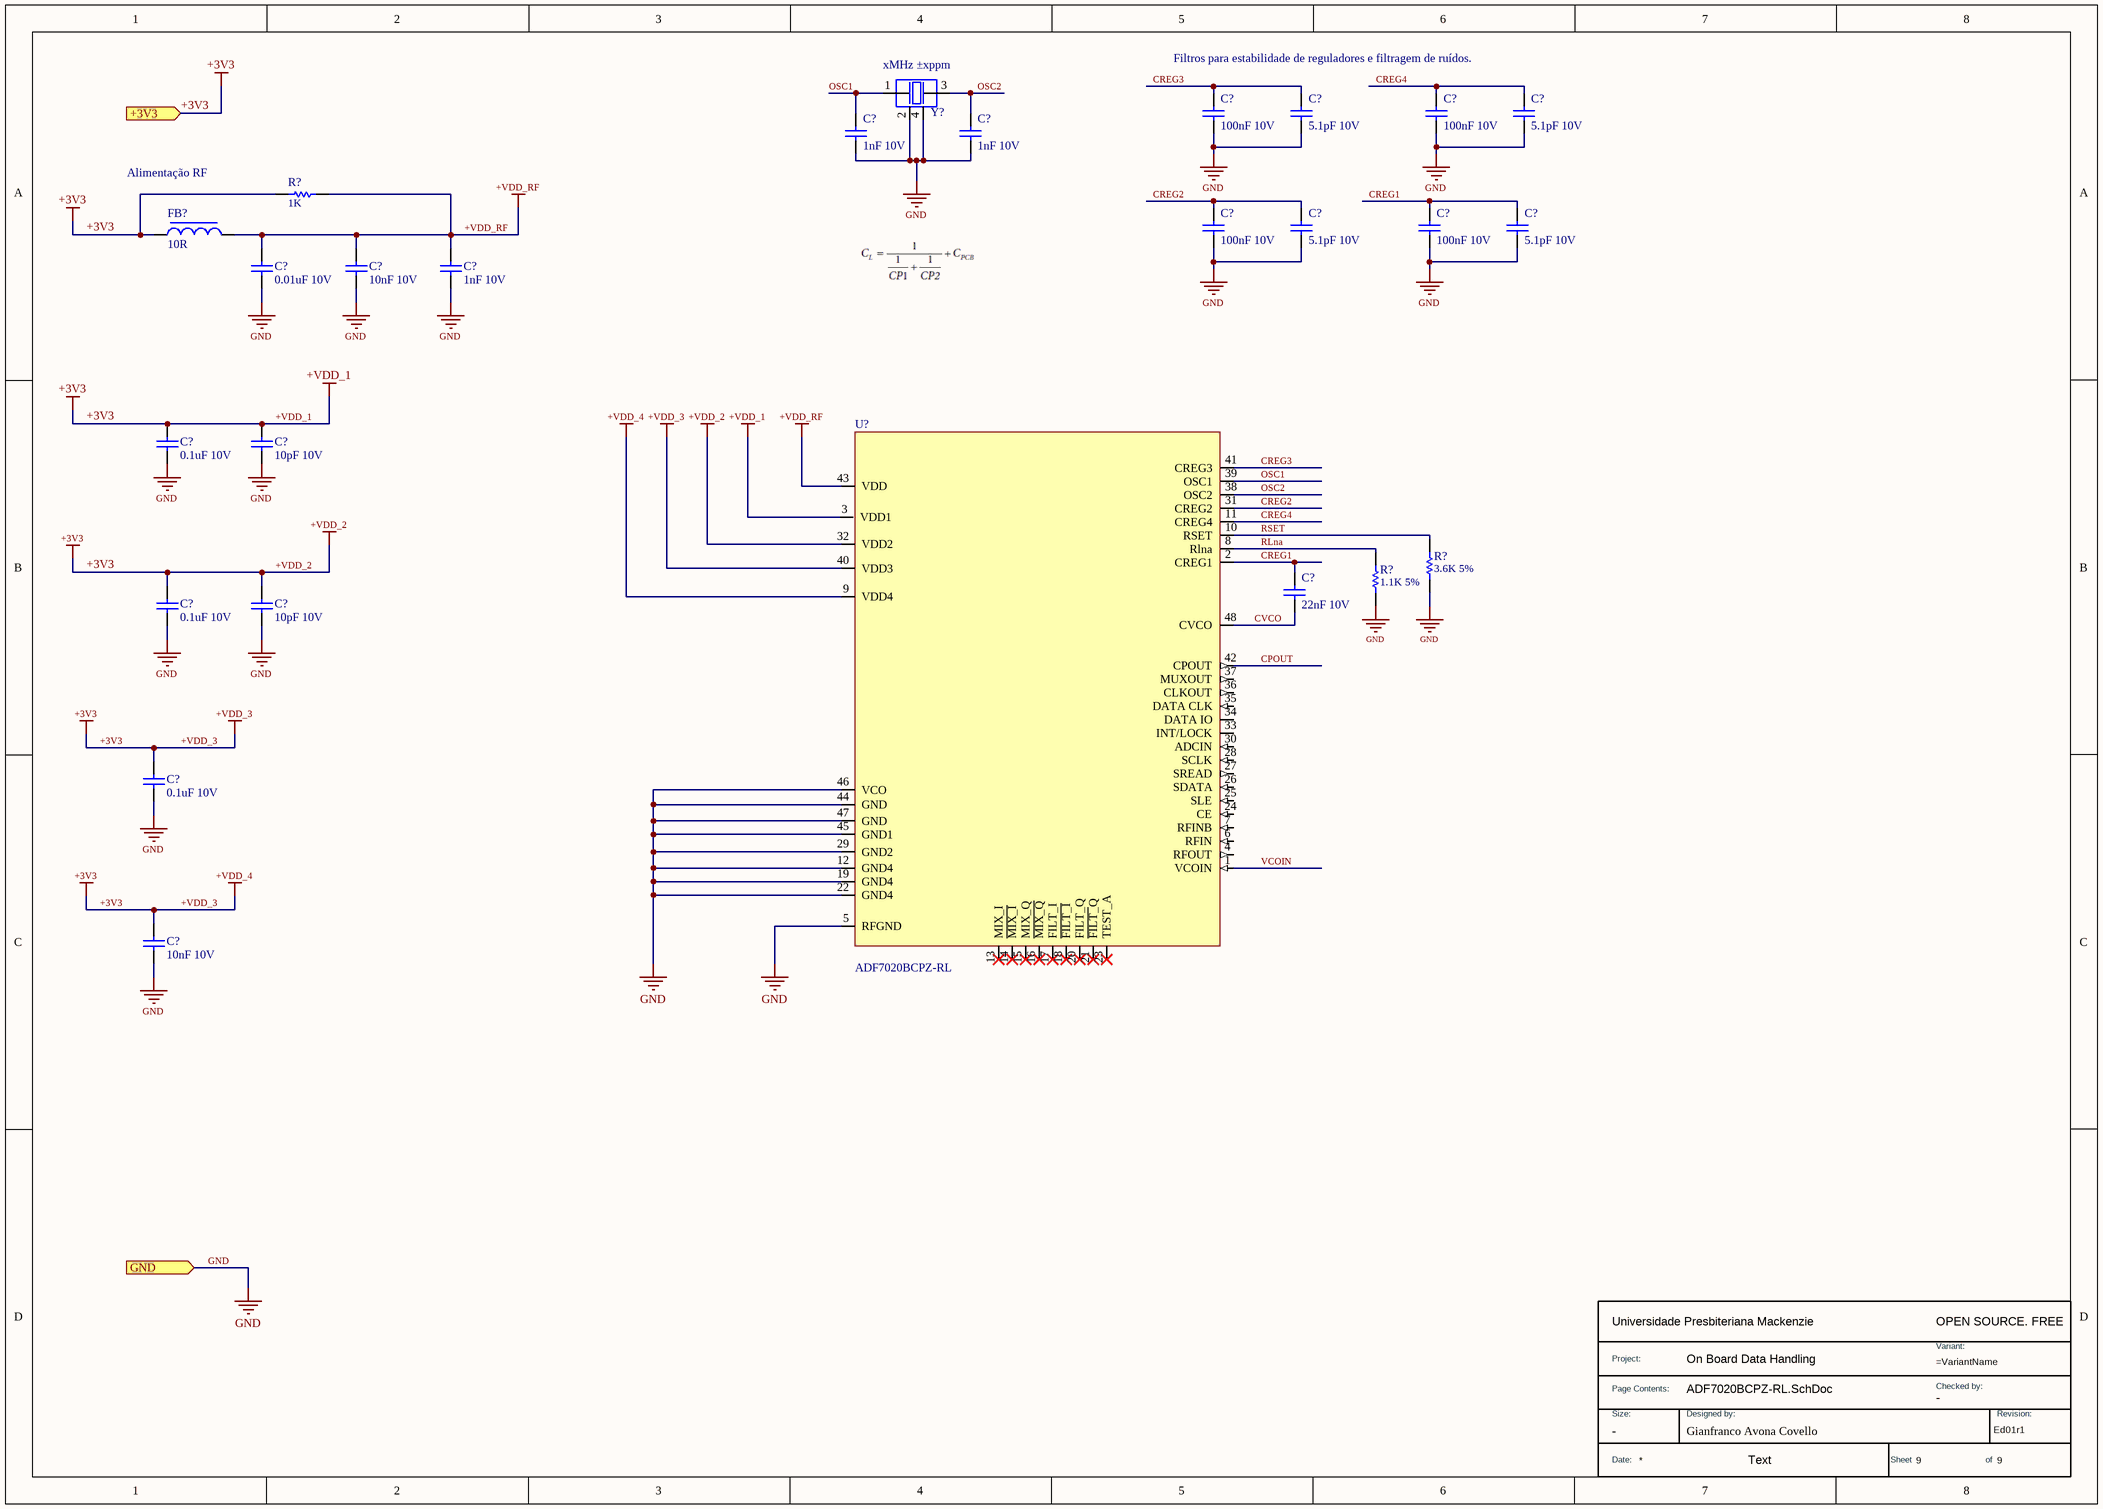
[diagram p11: ADF7020BCPZ-RL.SchDoc]

### Parts
(Parts that share a designator on the sheet are numbered #1, #2 ... from top to bottom, then left to right.)
*#9  DWG NO: Gianfranco Avona Covello  (hidden comment: TitleBlock)  (graphical)
C?#16  value 100nF 10V  (hidden comment: _Capacitor)
C?#17  value 5.1pF 10V  (hidden comment: _Capacitor)
C?#18  value 100nF 10V  (hidden comment: _Capacitor)
C?#19  value 5.1pF 10V  (hidden comment: _Capacitor)
C?#20  value 1nF 10V  (hidden comment: _Capacitor)
C?#21  value 1nF 10V  (hidden comment: _Capacitor)
C?#22  value 100nF 10V  (hidden comment: _Capacitor)
C?#23  value 5.1pF 10V  (hidden comment: _Capacitor)
C?#24  value 100nF 10V  (hidden comment: _Capacitor)
C?#25  value 5.1pF 10V  (hidden comment: _Capacitor)
C?#26  value 0.01uF 10V  (hidden comment: _Capacitor)
C?#27  value 10nF 10V  (hidden comment: _Capacitor)
C?#28  value 1nF 10V  (hidden comment: _Capacitor)
C?#29  value 0.1uF 10V  (hidden comment: _Capacitor)
C?#30  value 10pF 10V  (hidden comment: _Capacitor)
C?#31  value 22nF 10V  (hidden comment: _Capacitor)
C?#32  value 0.1uF 10V  (hidden comment: _Capacitor)
C?#33  value 10pF 10V  (hidden comment: _Capacitor)
C?#34  value 0.1uF 10V  (hidden comment: _Capacitor)
C?#35  value 10nF 10V  (hidden comment: _Capacitor)
FB?#4  value 10R  (hidden comment: _FERRITE)
R?#7  value 1K  (hidden comment: _Resistor)
R?#8  value 3.6K 5%  (hidden comment: _Resistor)
R?#9  value 1.1K 5%  (hidden comment: _Resistor)
U?#4  ADF7020BCPZ-RL
Y?#3  Valor: xMHz ±xppm  (hidden comment: _Crystal)

### Ports
+3V3 (in, see 1[6B]), GND (in, see 1[3C], 2[4A], 4[1A])

### Nets
+3V3: C?#29.1 C?#30.1 C?#32.1 C?#33.1 C?#34.1 C?#35.1 FB?#4.1 R?#7.1 U?#4.3(VDD1) U?#4.9(VDD4) U?#4.32(VDD2) U?#4.40(VDD3) ; port +3V3  [also labelled +VDD_1, +VDD_2, +VDD_3, +VDD_4]
+VDD_RF: C?#26.1 C?#27.1 C?#28.1 FB?#4.2 R?#7.2 U?#4.43(VDD)
GND: C?#16.2 C?#17.2 C?#18.2 C?#19.2 C?#20.2 C?#21.2 C?#22.2 C?#23.2 C?#24.2 C?#25.2 C?#26.2 C?#27.2 C?#28.2 C?#29.2 C?#30.2 C?#32.2 C?#33.2 C?#34.2 C?#35.2 R?#8.1 R?#9.1 U?#4.5(RFGND) U?#4.12(GND4) U?#4.19(GND4) U?#4.22(GND4) U?#4.29(GND2) U?#4.44(GND) U?#4.45(GND1) U?#4.46(VCO) U?#4.47(GND) Y?#3.2 Y?#3.4 ; port GND
CPOUT: U?#4.42(CPOUT)
CREG1: C?#24.1 C?#25.1 C?#31.1 U?#4.2(CREG1)
CREG2: C?#22.1 C?#23.1 U?#4.31(CREG2)
CREG3: C?#16.1 C?#17.1 U?#4.41(CREG3)
CREG4: C?#18.1 C?#19.1 U?#4.11(CREG4)
CVCO: C?#31.2 U?#4.48(CVCO)
OSC1: C?#20.1 U?#4.39(OSC1) Y?#3.1
OSC2: C?#21.1 U?#4.38(OSC2) Y?#3.3
RLna: R?#9.2 U?#4.8(Rlna)
RSET: R?#8.2 U?#4.10(RSET)
VCOIN: U?#4.1(VCOIN)

Not connected (* = marked no-connect by the designer): U?#4 4(RFOUT) 6(RFIN) 7(RFINB) 13(MIX_I)* 14(~{MIX_I})* 15(MIX_Q)* 16(~{MIX_Q})* 17(FILT_I)* 18(~{FILT_I})* 20(FILT_Q)* 21(~{FILT_}Q)* 23(TEST_A)* 24(CE) 25(SLE) 26(SDATA) 27(SREAD) 28(SCLK) 30(ADCIN) 33(INT/LOCK) 34(DATA_IO) 35(DATA_CLK) 36(CLKOUT) 37(MUXOUT)

### Notes on the sheet
- (near C?#16) Filtros para estabilidade de reguladores e filtragem de ruídos.
- Alimentação RF
- Todas as informações e detalhes técnicos deste documento são de inteira propriedade da empresa V2COM,
- não poderão ser copiados, reduzidos ou cedidos a terceiros sem prévia autorização por escrito da mesma.
- Salvo em (D/M/A):
- Página:
- de
- Nome do Projeto:
- https://v2com.com/
- Ed.:
- Responsável:
- Nome da página:
- Rev.:
- Projetista:
- Obs.:
- Revisor:
- Arquivo:
- -
- (in symbol TitleBlock) OPEN SOURCE. FREE; Project:; Variant:; Page Contents:; Checked by:; Size:; Designed by:; Revision:; Date:; Text; Sheet; of

### Library data of the parts
*#9 = TitleBlock: Standard Title Block; Size: -; Checked by: -
C?#16-C?#35 = _Capacitor: Capacitor; Published: 8-Jun-2000; LatestRevisionDate: 17-Jul-2002; LatestRevisionNote: Re-released for DXP Platform.; PackageReference: RAD-0.3; Publisher: Altium Limited; PackageDescription: Radial Cap, Thru-Hole; 2 Leads; 0.3 in Pin Spacing
FB?#4 = _FERRITE: Ferrite Bead; Code_IEC: 1005; Published: 8-Jun-2000; LatestRevisionDate: 29-May-2009; LatestRevisionNote: IPC-7351 Footprint Added.; PackageReference: 0402-A; Publisher: Altium Limited; PackageDescription: Chip Inductor; Code_JEITA: 0402
R?#7-R?#9 = _Resistor: Resistor; Published: 8-Jun-2000; LatestRevisionDate: 17-Jul-2002; LatestRevisionNote: Re-released for DXP Platform.; PackageReference: AXIAL-0.3; Publisher: Altium Limited; PackageDescription: Axial Device, Thru-Hole; 2 Leads; 0.3 in Pin Spacing
U?#4 = ADF7020BCPZ-RL: IC RF TXRX ISM<1GHZ 48VFQFN; Manufacturer: Analog Devices Inc.; Detailed Description: IC RF TxRx Only General ISM < 1GHz 431MHz ~ 478MHz, 862MHz ~ 956MHz 48-VFQFN Exposed Pad, CSP; Manufacturer Part Number: ADF7020BCPZ-RL
Y?#3 = _Crystal: as Y?#1 on sheet STM32L412CBT6; Case/Package: SMD; Observação: *

## Nets that join several sheets
+3V3: BLOCO_ALIMENTAÇÃO (TP3.1), REG_LIN_3V3_1A_TPS78533 (C9.1 C10.1 C11.1 U1.1), STM32L412CBT6 (5 pins), MLX90393SLQ (FB?#3.1 R?#6.1), ADF7020BCPZ-RL (12 pins)
+5V: BLOCO_ALIMENTAÇÃO (TP2.1), REG_CHAV_5V_3A_ST1S40IDR (5 pins), REG_LIN_3V3_1A_TPS78533 (C12.1 C13.1 U1.7 U1.8)
+VUSB_FILT: BLOCO_ALIMENTAÇÃO (TP1.1), USB4105 (C7.2 C8.2 FB1.2), REG_CHAV_5V_3A_ST1S40IDR (5 pins)
GND: USB4105 (7 pins), REG_CHAV_5V_3A_ST1S40IDR (9 pins), REG_LIN_3V3_1A_TPS78533 (6 pins), STM32L412CBT6 (19 pins), MLX90393SLQ (6 pins), LSM6DSOTR (5 pins), ADF7020BCPZ-RL (32 pins)

## Assembly variants
NoVariant: all parts fitted